# Altium schematic sheet JK_FF.SchDoc
size A
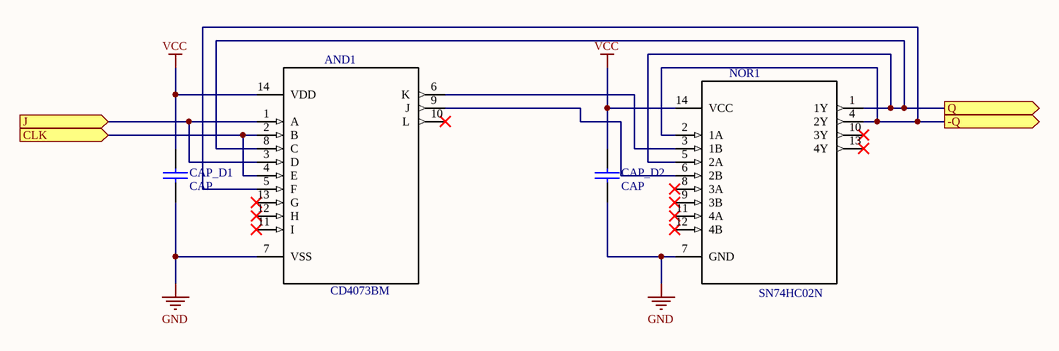
[diagram p0: JK_FF.SchDoc]

## Parts
AND1  CD4073BM  [*SOIC127P600X175-14N]
CAP_D1  CAP  [CAP200]
CAP_D2  CAP  [CAP200]
NOR1  SN74HC02N  [*DIP254P762X508-14]

## Ports
-Q (out), CLK (in), J (in), Q (out)

## Nets
GND: AND1.7(VSS) CAP_D1.2 CAP_D2.1 NOR1.7(GND)
VCC: AND1.14(VDD) CAP_D1.1 CAP_D2.2 NOR1.14(VCC)
-Q: AND1.5(F) NOR1.2(1A) NOR1.4(2Y) ; port -Q
CLK: AND1.2(B) AND1.4(E) ; port CLK
J: AND1.1(A) AND1.3(D) ; port J
Q: AND1.8(C) NOR1.1(1Y) NOR1.5(2A) ; port Q
NetAND1_6: AND1.6(K) NOR1.3(1B)
NetAND1_9: AND1.9(J) NOR1.6(2B)

Not connected (* = marked no-connect by the designer): AND1 10(L)* 11(I)* 12(H)* 13(G)*; NOR1 8(3A)* 9(3B)* 10(3Y)* 11(4A)* 12(4B)* 13(4Y)*

## Library data of the parts
AND1 = CD4073BM: IC: digital; AND; Channels: 3; Inputs: 3; CMOS; SMD; SOP1; MF: Texas Instruments; Price: None; Package: SOIC-14 Texas Instruments; Availability: Unavailable; SnapEDA_Link: https://www.snapeda.com/parts/CD4073BM/Texas%20Instruments/view-part/?ref=snap; MP: CD4073BM; Value: *
NOR1 = SN74HC02N: IC: digital; Channels: 4; NOR; Inputs: 2; THT; DIP14; Ser; MF: Texas Instruments; Price: None; Package: DIP-14 Texas Instruments; Availability: Unavailable; SnapEDA_Link: https://www.snapeda.com/parts/SN74HC02N/Texas%20Instruments/view-part/?ref=snap; MP: SN74HC02N; Value: *